# EasyEDA Pro project 2022年第十三届立创EDA出品模拟题2.eprj

# Schematic 【蓝桥杯练习题二】第十三届蓝桥杯EDA赛模拟题
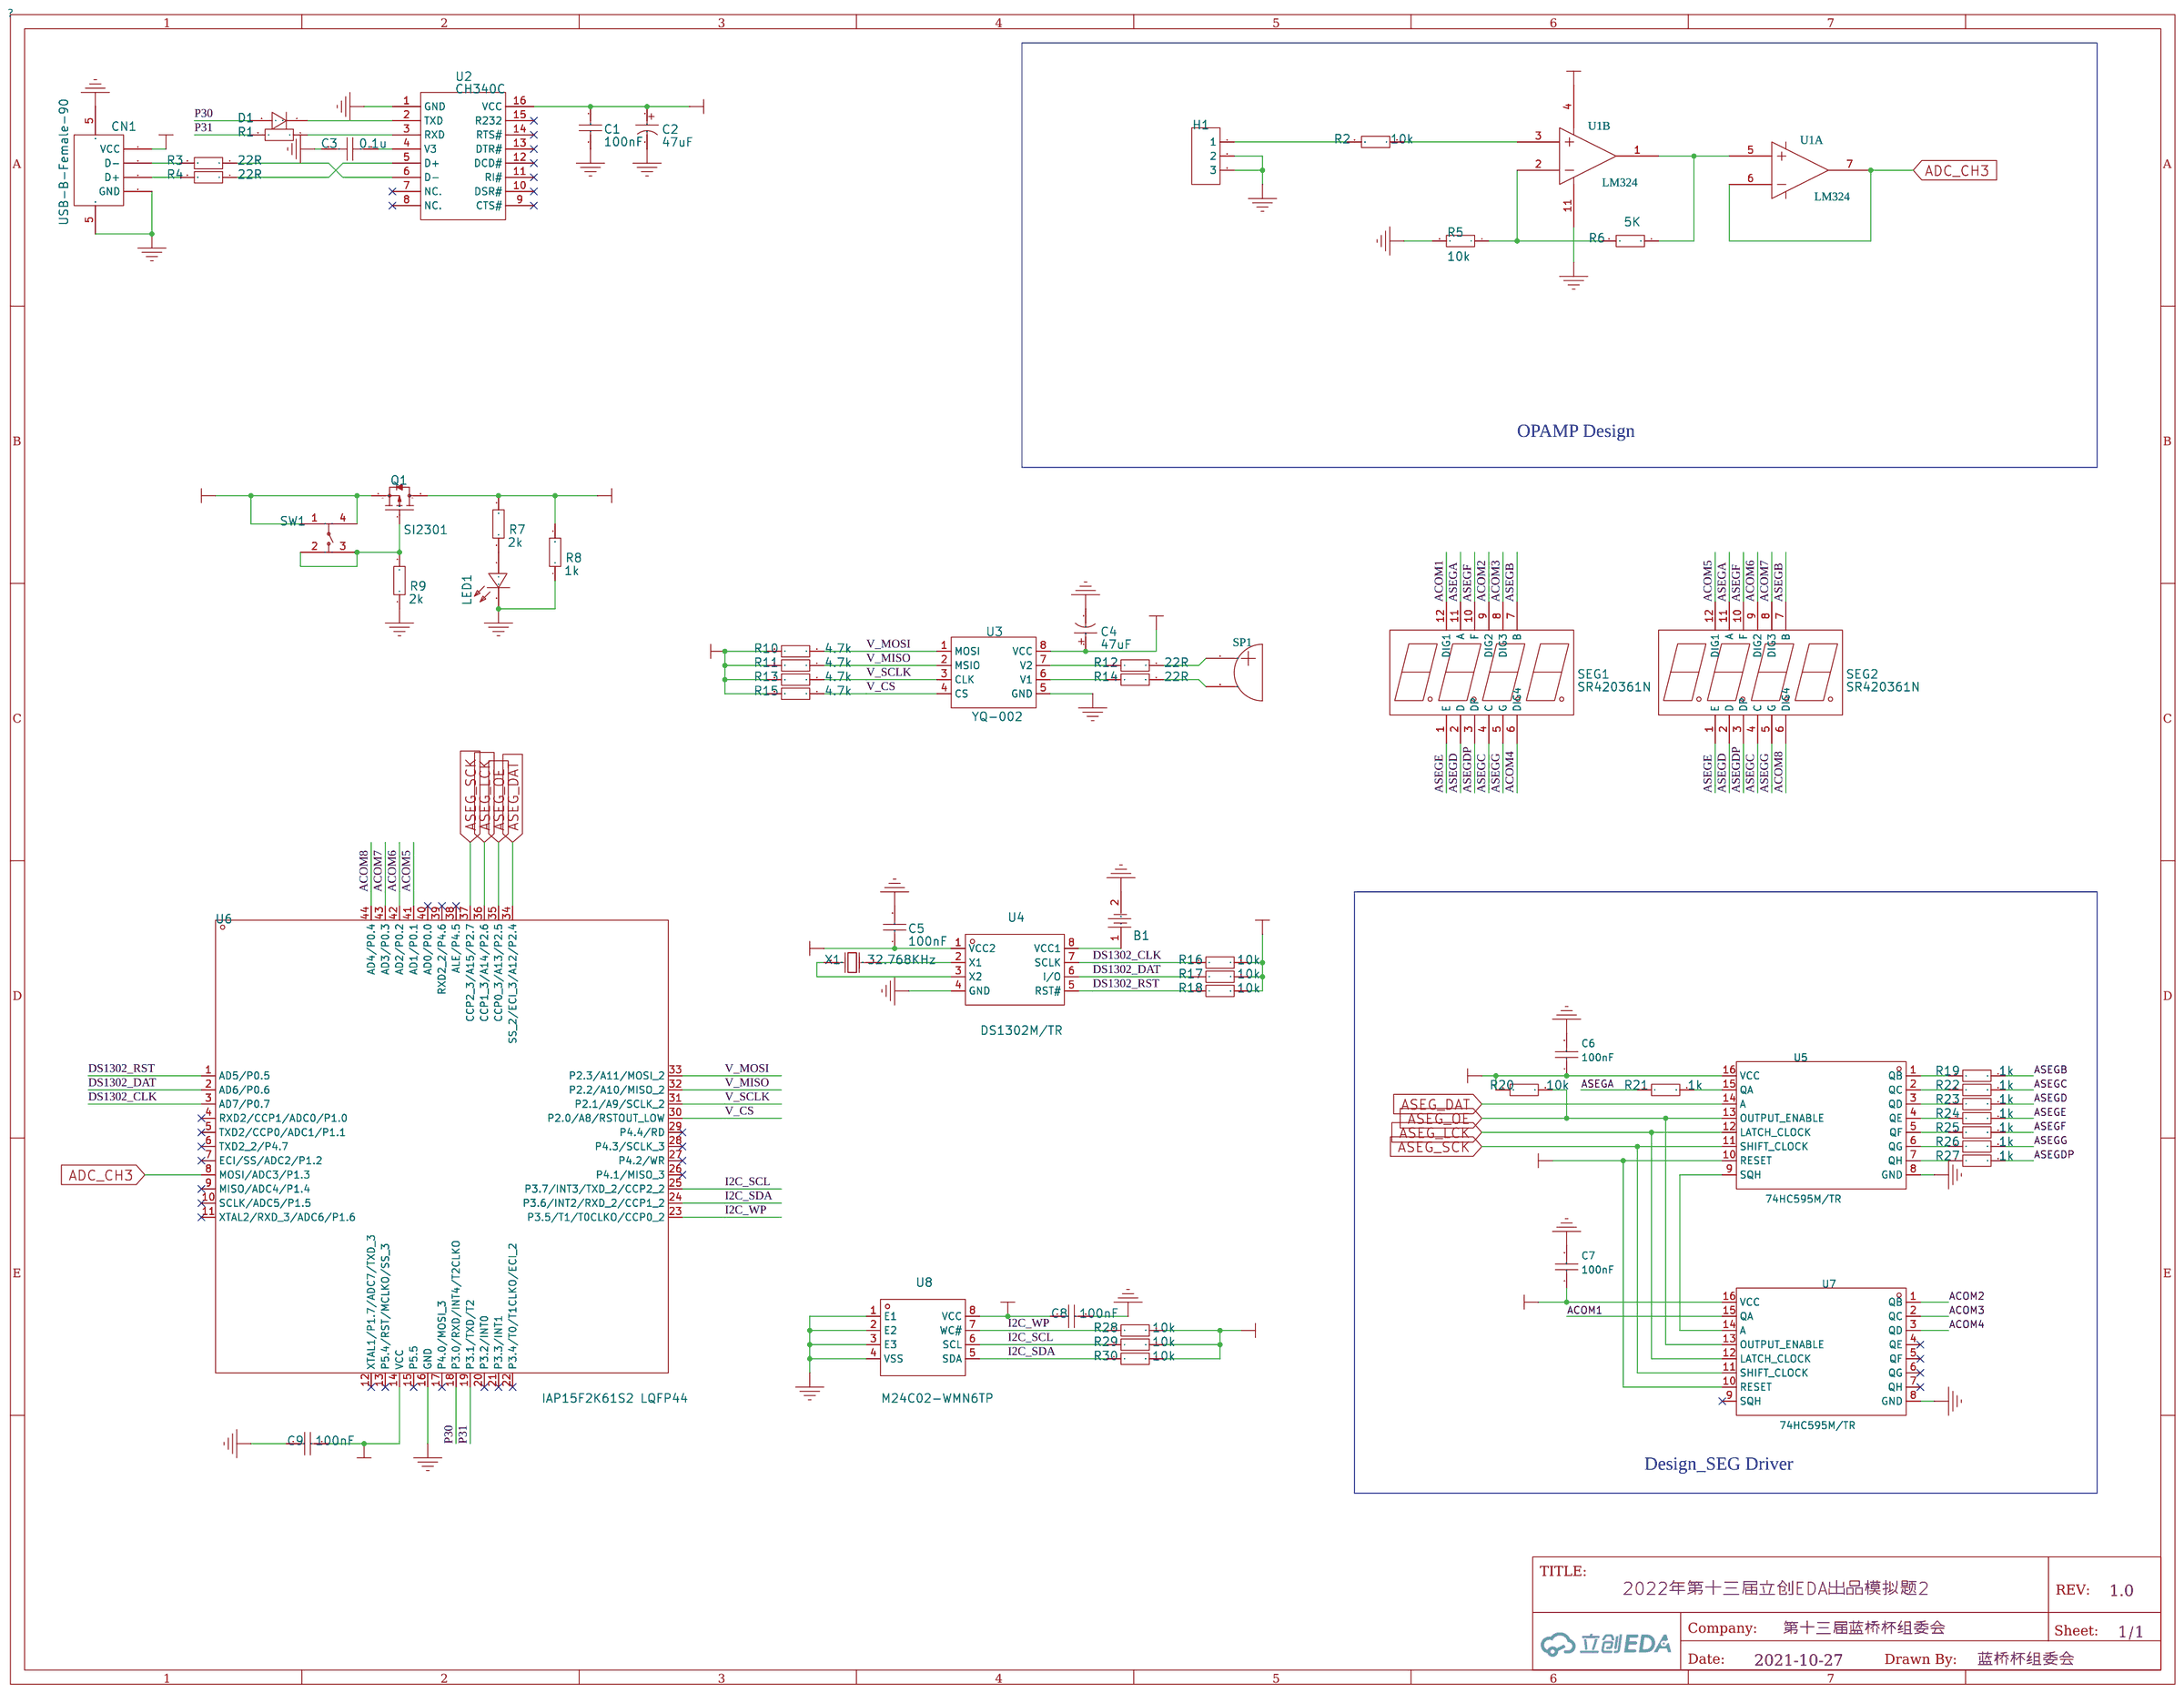
[diagram p0: schematic sheet]

## Parts
B1  CR1220-2  [BAT-CR1220]
C1  100nF  [C0805]
C2  47uF  [CAP]
C3  0.1u  [C0805]
C4  47uF  [CAP]
C5  100nF  [C0805]
C6  100nF  [C0805]
C7  100nF  [C0805]
C8  100nF  [C0805]
C9  100nF  [C0805]
CN1  USB-B-Female-90  [USB-B]
D1  KLL4148  [DIODE]
H1  HDR-F-2.54_1x3  [HDR-F-2.54_1X3]
LED1  17-21URC/TR8  [LED0805]
Q1  SI2301  [SOT-23-3]
R1  1k  [R0805]
R2  10k  [R0805]
R3  22R  [R0805]
R4  22R  [R0805]
R5  10k  [R0805]
R6  5K  [R0805]
R7  2k  [R0805]
R8  1k  [R0805]
R9  2k  [R0805]
R10  4.7k  [R0805]
R11  4.7k  [R0805]
R12  22R  [R0805]
R13  4.7k  [R0805]
R14  22R  [R0805]
R15  4.7k  [R0805]
R16  10k  [R0805]
R17  10k  [R0805]
R18  10k  [R0805]
R19  1k  [R0805]
R20  10k  [R0805]
R21  1k  [R0805]
R22  1k  [R0805]
R23  1k  [R0805]
R24  1k  [R0805]
R25  1k  [R0805]
R26  1k  [R0805]
R27  1k  [R0805]
R28  10k  [R0805]
R29  10k  [R0805]
R30  10k  [R0805]
SEG1  SR420361N  [LED-SEG]
SEG2  SR420361N  [LED-SEG]
SP1  BUZZER  [BUZZ]
SW1  TS-1159UB-B-D-BL  [SW-SMD_4P]
U1  LM324  [SOIC-14]  (sections 1,2)
U2  CH340C  [SOP-16]
U3  YQ-002  [SOP-8]
U4  DS1302M/TR  [SOP-8]
U5  74HC595M/TR  [SOP-16]
U6  IAP15F2K61S2 LQFP44  [QFP-LQFP-44]
U7  74HC595M/TR  [SOP-16]
U8  M24C02-WMN6TP  [SOP-8]
X1  32.768KHz  [XTAL-DT38]

## Library data of the parts
B1 = CR1220-2: Supplier: LCSC; Manufacturer: Q&amp;J; image: //image.lceda.cn/szlcsc/C70381.jpg; Supplier Part: C70381
C1 C5 C8 C9 = 0805F104M500NT: Supplier: LCSC; Manufacturer: FH; Supplier Part: C28378
C2 C4 = VES470M1HTR-0607: Supplier: LCSC; Manufacturer: LELON; Supplier Part: C108053; JLCPCB Part Class: Extended Part
C3 = 0.1u
C6 C7 = 100nF
CN1 = USB-BF90: Supplier: LCSC; Manufacturer: ValuePro; image: //image.lceda.cn/szlcsc/C46392.jpg; Supplier Part: C46392
D1 = KLL4148: Supplier: LCSC; Supplier Part: C369941; Manufacturer: KEXIN
H1 = HDR-F-2.54_1x3: Supplier Part: C146690; Supplier: LCSC
LED1 = 17-21URC/TR8: Supplier: LCSC; Supplier Part: C264414; Manufacturer: Everlight Elec
Q1 = SI2301: Supplier: LCSC; Manufacturer: Hottech; Supplier Part: C181086; JLCPCB Part Class: Extend
R1-R30 = 080500J0104T5E: Supplier: LCSC; Manufacturer: UniOhm; Supplier Part: C149503
SEG1 SEG2 = SR420361N: Supplier: LCSC; Supplier Part: C98926; Manufacturer: Wuxi ARK Tech Elec; JLCPCB Part Class: Extended Part
SP1 = BUZZER
SW1 = TS-1159UB-B-D-BL: Supplier: LCSC; Supplier Part: C692480; Manufacturer: XKB Connectivity
U1 = LM324
U2 = CH340C: Supplier: LCSC; Manufacturer: WCH; Supplier Part: C84681; JLCPCB Part Class: Extend
U3 = YQ-002
U4 = DS1302M/TR: Supplier: LCSC; Supplier Part: C434511; Manufacturer: HGSEMI
U5 U7 = 74HC595M/TR
U6 = IAP15F2K61S2 LQFP44: Supplier: LCSC; Manufacturer: STC; Supplier Part: C47451; JLCPCB Part Class: Extend
U8 = M24C02-WMN6TP: Supplier: LCSC; Manufacturer: STMicroelectronics; image: //image.lceda.cn/szlcsc/C7562.jpg; Supplier Part: C7562; JLCPCB Part Class: Basic
X1 = 6K832768F12UB: Supplier: LCSC; Supplier Part: C252404; Manufacturer: SHENZHEN CRYSTAL TECH

## Nets
GND: B1.2 C1.1 C2.2 C3.1 C4.2 C5.2 C6.2 C7.2 C8.2 C9.1 CN1.4(GND) CN1.5(SH2) H1.2 H1.3 LED1.2(K) R5.2 R8.1 R9.1 U1.11 U2.1(GND) U3.5(GND) U4.4(GND) U5.8(GND) U6.16(GND) U7.8(GND) U8.1(E1) U8.2(E2) U8.3(E3) U8.4(VSS)
VDD_NODE_A: C4.1 C5.1 C6.1 C7.1 C8.1 C9.2 Q1.3(D) R7.2 R8.2 R10.2 R11.2 R13.2 R15.2 R16.2 R17.2 R18.2 R20.1 R28.2 R29.2 R30.2 U1.4 U3.8(VCC) U4.1(VCC2) U5.10(RESET) U5.16(VCC) U6.14(VCC) U7.10(RESET) U7.16(VCC) U8.8(VCC)
ACOM1: SEG1.12(DIG1) U7.15(QA)
ACOM2: SEG1.9(DIG2) U7.1(QB)
ACOM3: SEG1.8(DIG3) U7.2(QC)
ACOM4: SEG1.6(DIG4) U7.3(QD)
ACOM5: SEG2.12(DIG1) U6.41(AD1/P0.1)
ACOM6: SEG2.9(DIG2) U6.42(AD2/P0.2)
ACOM7: SEG2.8(DIG3) U6.43(AD3/P0.3)
ACOM8: SEG2.6(DIG4) U6.44(AD4/P0.4)
ADC_CH3: U1.6 U1.7 U6.8(MOSI/ADC3/P1.3)
ASEG_DAT: U5.14(A) U6.34(SS_2/ECI_3/A12/P2.4)
ASEG_LCK: U5.12(LATCH_CLOCK) U6.36(CCP1_3/A14/P2.6) U7.12(LATCH_CLOCK)
ASEG_OE: R20.2 U5.13(OUTPUT_ENABLE) U6.35(CCP0_3/A13/P2.5) U7.13(OUTPUT_ENABLE)
ASEG_SCK: U5.11(SHIFT_CLOCK) U6.37(CCP2_3/A15/P2.7) U7.11(SHIFT_CLOCK)
ASEGA: R21.1 SEG1.11(A) SEG2.11(A)
ASEGB: R19.2 SEG1.7(B) SEG2.7(B)
ASEGC: R22.2 SEG1.4(C) SEG2.4(C)
ASEGD: R23.2 SEG1.2(D) SEG2.2(D)
ASEGDP: R27.2 SEG1.3(DP) SEG2.3(DP)
ASEGE: R24.2 SEG1.1(E) SEG2.1(E)
ASEGF: R25.2 SEG1.10(F) SEG2.10(F)
ASEGG: R26.2 SEG1.5(G) SEG2.5(G)
DS1302_CLK: R16.1 U4.7(SCLK) U6.3(AD7/P0.7)
DS1302_DAT: R17.1 U4.6(I/O) U6.2(AD6/P0.6)
DS1302_RST: R18.1 U4.5(RST#) U6.1(AD5/P0.5)
I2C_SCL: R29.1 U6.25(P3.7/INT3/TXD_2/CCP2_2) U8.6(SCL)
I2C_SDA: R30.1 U6.24(P3.6/INT2/RXD_2/CCP1_2) U8.5(SDA)
I2C_WP: R28.1 U6.23(P3.5/T1/T0CLKO/CCP0_2) U8.7(WC#)
P30: D1.2(A) U6.18(P3.0/RXD/INT4/T2CLKO)
P31: R1.2 U6.19(P3.1/TXD/T2)
V_CS: R15.1 U3.4(CS) U6.30(P2.0/A8/RSTOUT_LOW)
V_MISO: R11.1 U3.2(MSIO) U6.32(P2.2/A10/MISO_2)
V_MOSI: R10.1 U3.1(MOSI) U6.33(P2.3/A11/MOSI_2)
V_SCLK: R13.1 U3.3(CLK) U6.31(P2.1/A9/SCLK_2)
VUSB: C1.2 C2.1 CN1.1(VCC) Q1.2(S) SW1.1 SW1.4(2) U2.16(VCC)
$1N50: H1.1 R2.2
$1N51: R2.1 U1.3
$1N54: R5.1 R6.2 U1.2
$1N55: R6.1 U1.1 U1.5
$1N115: B1.1 U4.8(VCC1)
$1N118: U4.3(X2) X1.1(OSC1)
$1N119: U4.2(X1) X1.2(OSC2)
$1N152: R14.1 U3.6(V1)
$1N153: R12.1 U3.7(V2)
$1N156: R14.2 SP1.2
$1N157: R12.2 SP1.1
$1N174: Q1.1(G) R9.2 SW1.2(4) SW1.3
$1N177: R4.1 U2.5(D+)
$1N178: R3.1 U2.6(D-)
$1N181: C3.2 U2.4(V3)
$1N182: R1.1 U2.3(RXD)
$1N183: D1.1(C) U2.2(TXD)
$1N192: CN1.3(D+) R4.2
$1N193: CN1.2(D-) R3.2
$1N730: LED1.1(A) R7.1
$1N1892: R21.2 U5.15(QA)
$1N2944: R27.1 U5.7(QH)
$1N2950: R26.1 U5.6(QG)
$1N2953: R25.1 U5.5(QF)
$1N2956: R24.1 U5.4(QE)
$1N2959: R23.1 U5.3(QD)
$1N2962: R22.1 U5.2(QC)
$1N2965: R19.1 U5.1(QB)
$1N3067: U5.9(SQH) U7.14(A)

Not connected (* = marked no-connect by the designer): U2 7(NC.)* 8(NC.)* 9(CTS#)* 10(DSR#)* 11(RI#)* 12(DCD#)* 13(DTR#)* 14(RTS#)* 15(R232)*; U6 4(RXD2/CCP1/ADC0/P1.0)* 5(TXD2/CCP0/ADC1/P1.1)* 6(TXD2_2/P4.7)* 7(ECI/SS/ADC2/P1.2)* 9(MISO/ADC4/P1.4)* 10(SCLK/ADC5/P1.5)* 11(XTAL2/RXD_3/ADC6/P1.6)* 12(XTAL1/P1.7/ADC7/TXD_3)* 13(P5.4/RST/MCLKO/SS_3)* 15(P5.5)* 17(P4.0/MOSI_3)* 20(P3.2/INT0)* 21(P3.3/INT1)* 22(P3.4/T0/T1CLKO/ECI_2)* 26(P4.1/MISO_3)* 27(P4.2/WR)* 28(P4.3/SCLK_3)* 29(P4.4/RD)* 38(ALE/P4.5)* 39(RXD2_2/P4.6)* 40(AD0/P0.0)*; U7 4(QE)* 5(QF)* 6(QG)* 7(QH)* 9(SQH)*

## Notes on the sheet
- OPAMP Design
- Design_SEG Driver

# Board PCB
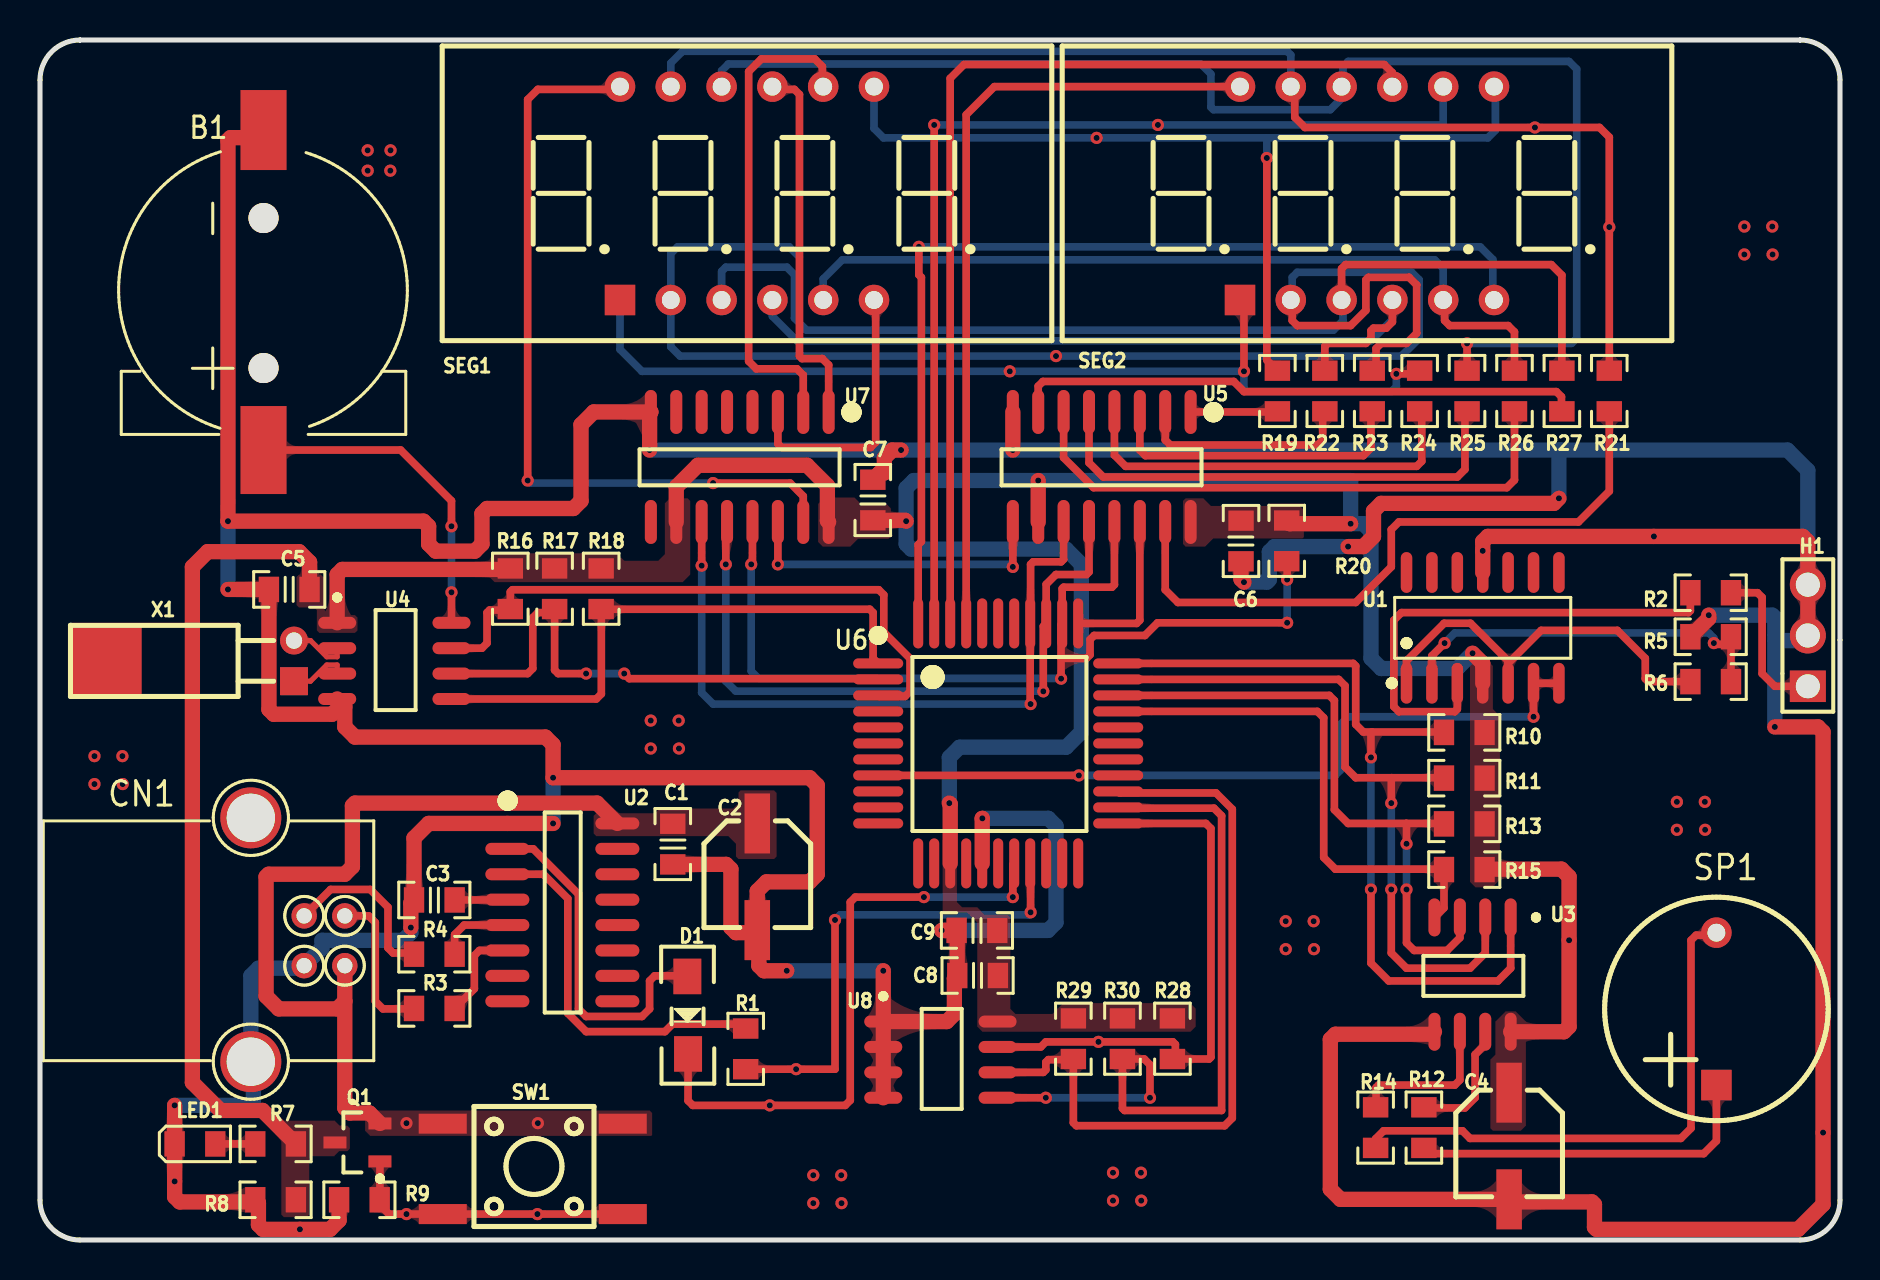
[diagram p1: board, top side]
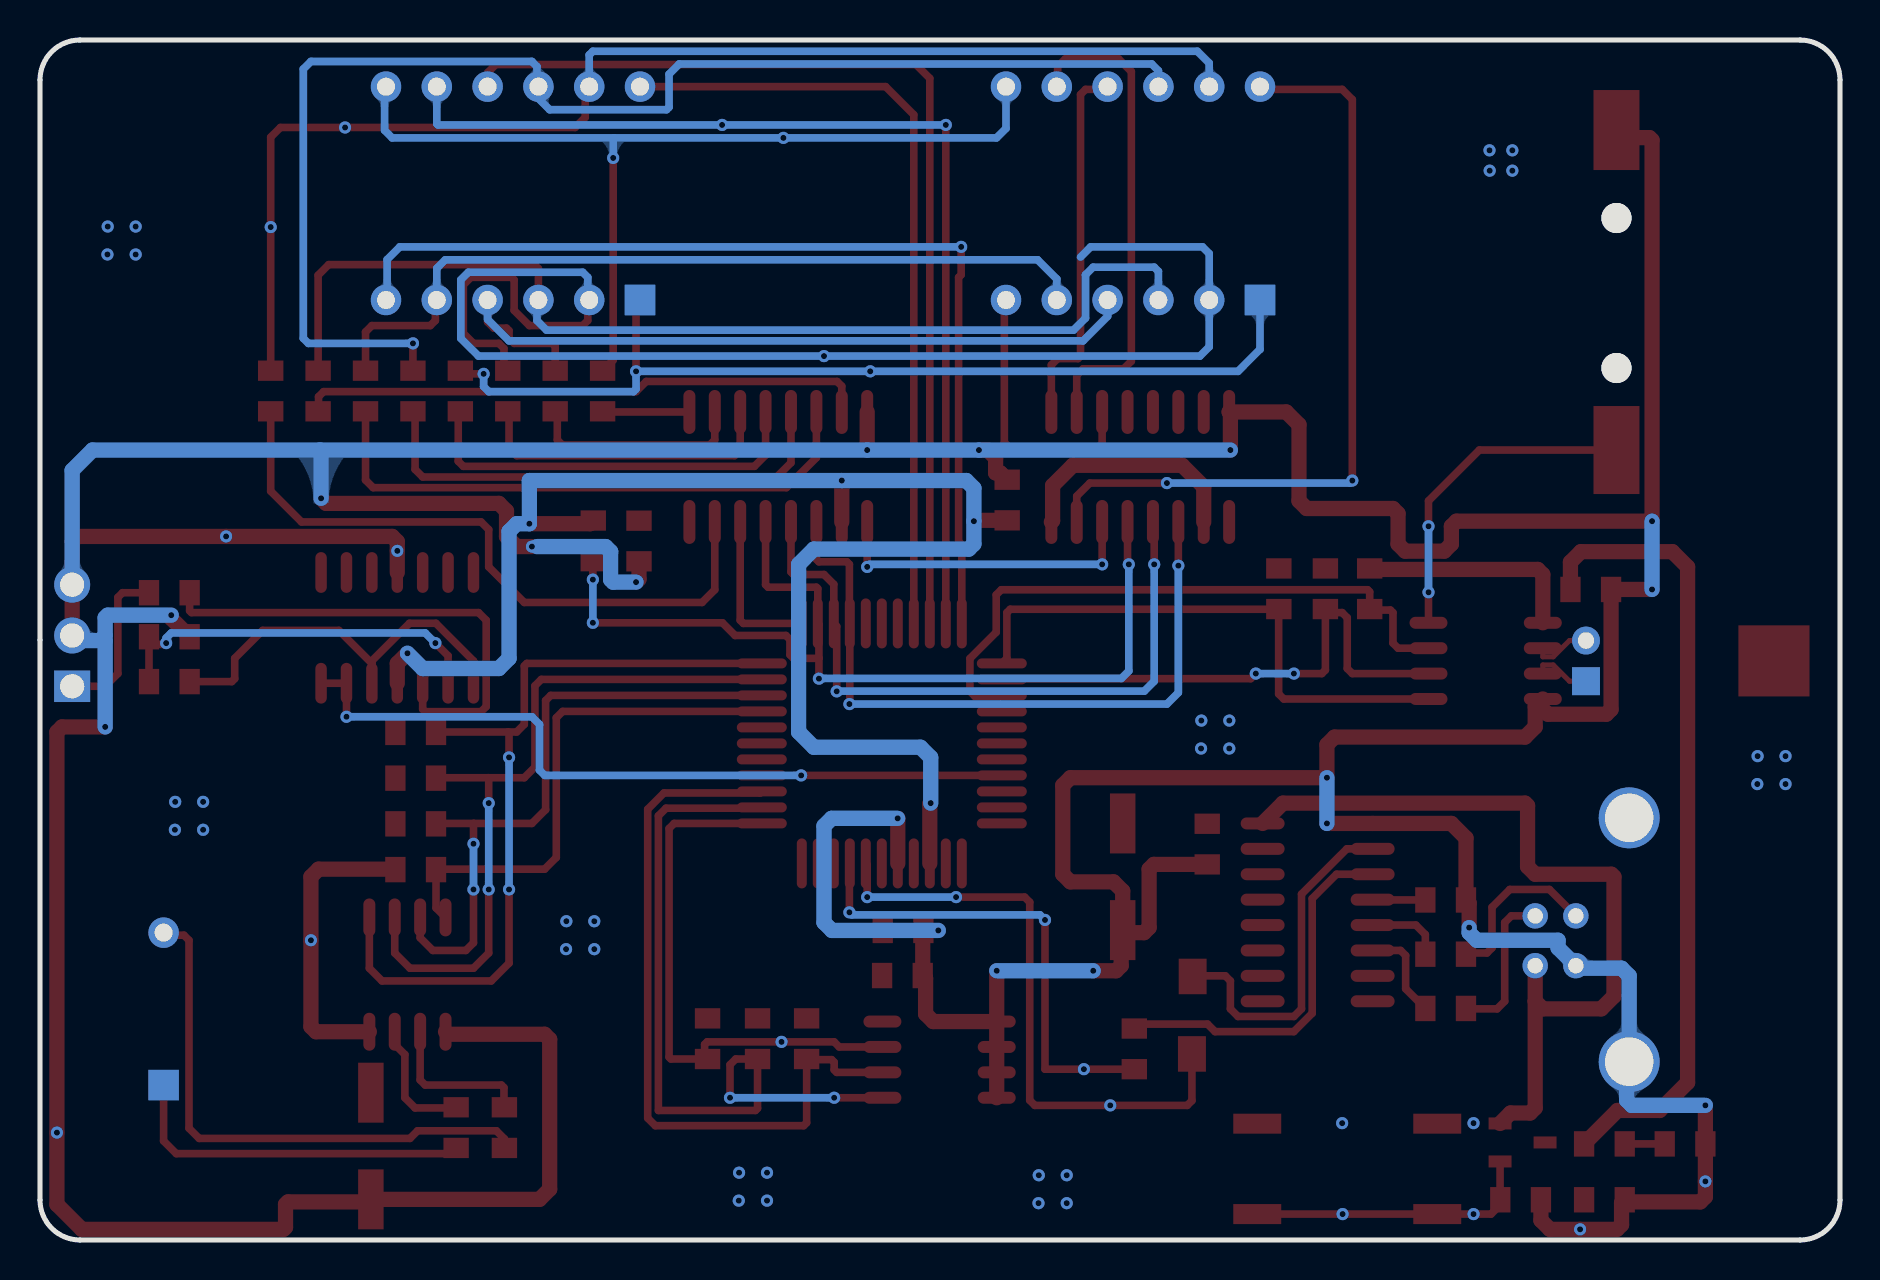
[diagram p2: board, bottom side, seen from below]

Outline 90 x 60 mm; copper layers: Top Layer, Inner1, Inner2, Bottom Layer. Coordinates in mm from the lower left corner of the outline.
Outline path: 0,58 0,2 arc(0.59,0.59) 2,0 88,0 arc(89.41,0.59) 90,2 90,58 arc(89.41,59.41) 88,60 2,60 arc(0.59,59.41) 0,58
Stack: Top Layer 0.035mm / Dielectric1 0.48mm PP er 4.5 / Inner1 0.035mm / Dielectric2 0.48mm FR4 er 4.5 / Inner2 0.035mm / Dielectric3 0.48mm PP er 4.5 / Bottom Layer 0.035mm

## Design rules (mm)
net $1N119: DP1
net $1N118: DP1
template: 用户自定义配置
spacing Default (default): track to track 0.152, other pairs 0 to 0.152
track width Default (default): min 0.381, default 0.381, max 25.4
track width PWR: min 0.762, default 0.762, max 2.54
differential pair differentialPair (default): width min 0.127, default 0.254, max 2.54; gap min 0.152, default 0.152
via Default (default): diameter min 0.61, default 0.61, max 100.025; hole min 0.305, default 0.305, max 59.995
net GND uses PWR
net VDD_NODE_A uses PWR
net VUSB uses PWR

## Placement (name value [footprint] x y rotation side)
B1  CR1220-2  [BAT-CR1220]  11.18 47.5 90 top
C1  100nF  [C0805]  31.62 18.8 90 top
C2  47uF  [CAP]  35.94 20.95 270 top
C3  0.1u  [C0805]  18.72 17.02 0 top
C4  47uF  [CAP]  73.53 7.49 270 top
C5  100nF  [C0805]  13.46 32.51 180 top
C6  100nF  [C0805]  60.07 35.95 270 top
C7  100nF  [C0805]  41.62 36 90 top
C8  100nF  [C0805]  47.88 13.21 180 top
C9  100nF  [C0805]  45.85 15.49 0 top
CN1  USB-B-Female-90  [USB-B]  15.24 13.72 270 top
D1  KLL4148  [DIODE]  32.38 11.24 270 top
H1  HDR-F-2.54_1x3  [HDR-F-2.54_1X3]  88.39 30.23 90 top
LED1  17-21URC/TR8  [LED0805]  8.76 4.81 180 top
Q1  SI2301  [SOT-23-3]  15.87 4.88 180 top
R1  1k  [R0805]  35.31 10.54 270 top
R2  10k  [R0805]  82.55 32.39 0 top
R3  22R  [R0805]  20.7 11.56 180 top
R4  22R  [R0805]  20.7 14.27 180 top
R5  10k  [R0805]  84.52 30.14 180 top
R6  5K  [R0805]  82.55 27.94 0 top
R7  2k  [R0805]  10.8 4.83 0 top
R8  1k  [R0805]  10.8 2.03 0 top
R9  2k  [R0805]  14.99 2.03 0 top
R10  4.7k  [R0805]  70.23 25.4 0 top
R11  4.7k  [R0805]  70.23 23.11 0 top
R12  22R  [R0805]  69.22 6.6 270 top
R13  4.7k  [R0805]  70.23 20.83 0 top
R14  22R  [R0805]  66.8 6.6 270 top
R15  4.7k  [R0805]  70.23 18.54 0 top
R16  10k  [R0805]  23.5 31.58 90 top
R17  10k  [R0805]  25.71 31.58 90 top
R18  10k  [R0805]  28.04 31.58 90 top
R19  1k  [R0805]  61.85 41.47 90 top
R20  10k  [R0805]  62.36 35.94 270 top
R21  1k  [R0805]  78.49 43.43 270 top
R22  1k  [R0805]  64.22 41.47 90 top
R23  1k  [R0805]  66.59 41.47 90 top
R24  1k  [R0805]  68.96 41.47 90 top
R25  1k  [R0805]  71.33 41.47 90 top
R26  1k  [R0805]  73.7 41.47 90 top
R27  1k  [R0805]  76.07 41.47 90 top
R28  10k  [R0805]  56.6 9.08 90 top
R29  10k  [R0805]  51.65 9.08 90 top
R30  10k  [R0805]  54.1 9.08 90 top
SEG1  SR420361N  [LED-SEG]  29 47 0 top
SEG2  SR420361N  [LED-SEG]  60 47 0 top
SP1  BUZZER  [BUZZ]  83.82 7.75 90 top
SW1  TS-1159UB-B-D-BL  [SW-SMD_4P]  24.64 3.56 0 top
U1  LM324  [SOIC-14]  72.14 30.61 0 top
U2  CH340C  [SOP-16]  23.37 20.83 0 top
U3  YQ-002  [SOP-8]  73.53 16.13 270 top
U4  DS1302M/TR  [SOP-8]  14.86 30.86 0 top
U5  74HC595M/TR  [SOP-16]  57.53 41.4 270 top
U6  IAP15F2K61S2 LQFP44  [QFP-LQFP-44]  41.91 28.83 0 top
U7  74HC595M/TR  [SOP-16]  39.43 41.4 270 top
U8  M24C02-WMN6TP  [SOP-8]  42.16 10.92 0 top
X1  32.768KHz  [XTAL-DT38]  12.7 27.94 270 top

## Footprints (pads in the part's own frame, mm; a bottom-side part is the same pattern mirrored in y, then rotated)
BAT-CR1220
  custom 4.4x2.3 smd: 1(-8,0)
  custom 4x2.3 smd: 2(8,0)
  round 1.5 hole 1.5x1.505: 3(-3.9,-0.001) 4(3.6,-0.001)
BUZZ
  custom 1.524x1.524 hole 0.894x0.889: 1(0,0)
  round 1.524 hole 0.894x0.889: 2(7.62,0)
C0805
  rect 1.016x1.27 smd: 1(-0.016,-0.015) 2(2.016,-0.015)
CAP
  rect 3x1.274 smd: 1(0.127,-0.076) 2(5.461,-0.076)
DIODE
  rect 1.778x1.397 smd: 1(-1.937,-0.018) 2(1.938,0.018)
HDR-F-2.54_1X3
  rect 1.575x1.8 hole 1.2x1.205: 1(-2.54,0)
  round 1.8 hole 1.205x1.2: 2(0,0) 3(2.54,0)
LED0805
  rect 1.016x1.27 smd: 1(0,0) 2(2.032,0)
LED-SEG
  custom 1.524x1.524 hole 0.894x0.889: 1(0,0)
  round 1.524 hole 0.889x0.894: 2(2.54,0) 3(5.08,0) 4(7.62,0) 5(10.16,0) 6(12.7,0) 7(12.7,10.668) 8(10.16,10.668) 9(7.62,10.668) 10(5.08,10.668) 11(2.54,10.668) 12(0,10.668)
QFP-LQFP-44
  oval 2.5x0.5 smd: 1(0,0) 2(0,-0.8) 3(0,-1.6) 4(0,-2.4) 5(0,-3.2) 6(0,-4) 7(0,-4.8) 8(0,-5.6) 9(0,-6.4) 10(0,-7.2) 11(0,-8) 23(12,-8) 24(12,-7.2) 25(12,-6.4) 26(12,-5.6) 27(12,-4.8) 28(12,-4) 29(12,-3.2) 30(12,-2.4) 31(12,-1.6) 32(12,-0.8) 33(12,0)
  oval 0.5x2.5 smd: 12(2,-10) 13(2.8,-10) 14(3.6,-10) 15(4.4,-10) 16(5.2,-10) 17(6,-10) 18(6.8,-10) 19(7.6,-10) 20(8.4,-10) 21(9.2,-10) 22(10,-10) 34(10,2) 35(9.2,2) 36(8.4,2) 37(7.6,2) 38(6.8,2) 39(6,2) 40(5.2,2) 41(4.4,2) 42(3.6,2) 43(2.8,2) 44(2,2)
R0805
  rect 1.016x1.27 smd: 1(-0.032,-0.021) 2(2,-0.021)
SOIC-14
  oval 0.574x2.038 smd: 1(-3.81,-2.769) 2(-2.54,-2.769) 3(-1.27,-2.769) 4(0,-2.769) 5(1.27,-2.769) 6(2.54,-2.769) 7(3.81,-2.769) 8(3.81,2.769) 9(2.54,2.769) 10(1.27,2.769) 11(0,2.769) 12(-1.27,2.769) 13(-2.54,2.769) 14(-3.81,2.769)
SOP-8
  custom 1.897x0.6 smd: 1(0,0) 2(0,-1.27) 3(0,-2.54) 4(0,-3.81) 5(5.716,-3.81) 6(5.716,-2.54) 7(5.716,-1.27) 8(5.716,0)
SOP-16
  oval 2.198x0.6 smd: 1(0,0) 2(0,-1.27) 3(0,-2.54) 4(0,-3.81) 5(0,-5.08) 6(0,-6.35) 7(0,-7.62) 8(0,-8.89) 9(5.5,-8.89) 10(5.5,-7.62) 11(5.5,-6.35) 12(5.5,-5.08) 13(5.5,-3.81) 14(5.5,-2.54) 15(5.5,-1.27) 16(5.5,0)
SOT-23-3
  rect 1.15x0.6 smd: 1(-1.125,0.95) 2(-1.125,-0.95) 3(1.125,0)
SW-SMD_4P
  rect 2.4x1 smd: 1(-4.5,2.26) 2(-4.5,-2.26) 3(4.5,-2.26) 4(4.5,2.26)
USB-B
  round 1.27 hole 0.767x0.762: 1(0,0) 2(-2.49,0) 3(-2.49,-2.032) 4(0,-2.032)
  round 3.048 hole 2.418x2.413: 5(4.801,-4.699) 6(-7.391,-4.699)
XTAL-DT38
  custom 3.556x3.556 smd: 0(-1.016,-9.398)
  custom 1.397x1.397 hole 0.818x0.813: 1(0,0)
  round 1.397 hole 0.818x0.813: 2(-2.032,0)

## Nets
As in the schematic.

Pads without a net: B1 3 4; CN1 6; U1 8 9 10 12 13 14; U2 7 8 9 10 11 12 13 14 15; U6 4 5 6 7 9 10 11 12 13 15 17 20 21 22 26 27 28 29 38 39 40; U7 4 5 6 7 9; X1 0

## Via types
v1: diameter 0.61, hole 0.305, Top Layer to Bottom Layer, 112 vias

## Routing (per net, layer and track width the routed paths; a pad name or vN(x,y) marks a point on that pad's centre or on a via; arc(x,y) is an arc through that point)
GND: length 391.5
  Top Layer w0.762: 14.95,1.76 14.95,0.98 14.5,0.53 v1(13,0.53) 11.15,0.53 10.92,0.76 10.92,1.85 R8.1 10.66,1.91 6.98,1.91 6.73,2.16 v1(6.73,2.93) LED1.2 v1(6.73,6.73) ; R5.2 83.44,31.08 v1(83.44,31.24) ; v1(45.09,15.48) C9.1 45.86,15.45 C8.2 45.72,13.08 45.72,11.3 45.34,10.92 U8.1 ; C6.2 60.05,33.04 v1(60.2,32.89) ; v1(43.05,39.5) 42.61,39.5 42.22,39.1 42.22,38.35 41.98,38.35 C7.2 ; v1(9.4,32.53) C5.2 11.45,26.53 11.68,26.29 14.61,26.29 14.99,26.67 14.99,26.92 ; U8.1 v1(42.16,13.46) ; U8.1 U8.2 U8.3 U8.4 ; 14.99,26.92 U4.4 ; 14.99,26.92 15.24,26.67 15.24,25.65 15.75,25.15 25.27,25.15 25.65,24.77 v1(25.65,23.11) 38.48,23.11 38.86,22.73 38.86,18.29 38.48,17.91 36.32,17.91 35.86,17.45 C2.2 ; v1(75.95,37.08) 75.69,36.83 67.06,36.83 66.68,36.45 66.68,35.18 66.17,34.67 v1(65.41,34.67) ; v1(18.54,15.62) 18.54,16.84 C3.1 18.7,20.1 19.43,20.83 U2.1 v1(25.65,20.83) ; U1.11 v1(72.14,34.46) 72.14,34.92 72.39,35.18 v1(80.69,35.18) 88.14,35.18 88.39,34.92 H1.3 H1.2 ; C2.2 35.74,15.37 34.8,15.37 34.54,15.62 34.54,18.54 34.31,18.78 C1.1 ; C2.2 35.94,15.42 35.94,13.72 36.19,13.46 v1(37.34,13.46) ; v1(30.48,39.5) 30.48,41.34 U7.8 27.69,41.4 27.05,40.77 27.05,36.96 26.67,36.58 22.35,36.58 22.1,36.32 22.1,34.8 21.74,34.44 19.79,34.44 19.43,34.8 19.43,35.69 19.18,35.94 v1(9.4,35.94) 9.4,54.99 9.53,55.12 10.8,55.12 B1.2 ; v1(47.12,21.08) 47.11,21.08 U6.16 ; v1(48.64,39.5) 48.64,41.4 ; 69.72,10.41 69.6,10.29 64.77,10.29 64.52,10.03 64.52,2.54 65.02,2.03 C4.2 73.58,1.91 77.6,1.91 77.72,1.78 77.72,0.63 77.83,0.53 87.91,0.53 89.15,1.78 v1(89.15,5.37) 89.15,25.4 88.9,25.65 v1(86.74,25.65)
  Bottom Layer w0.762: H1.2 88.14,29.97 87,29.97 ; v1(86.74,25.65) 86.74,29.97 87,29.97 ; 87,29.97 86.74,30.23 86.74,31.11 86.61,31.24 v1(83.44,31.24) ; H1.3 88.39,38.48 87.38,39.5 76,39.5 ; v1(42.16,13.46) v1(37.34,13.46) ; v1(9.4,32.53) v1(9.4,35.94) ; v1(75.95,37.08) 75.95,39.44 76,39.5 ; 76,39.5 v1(48.64,39.5) v1(43.05,39.5) v1(30.48,39.5) ; v1(45.09,15.48) 50.4,15.48 50.8,15.88 50.8,20.7 50.42,21.08 v1(47.12,21.08) ; 65.15,34.67 61.72,34.67 61.47,34.42 61.47,33.02 61.34,32.89 v1(60.2,32.89) ; v1(18.54,15.62) 18.54,15.37 18.16,14.99 14.1,14.99 14.1,14.61 CN1.4 13.08,13.59 10.92,13.59 10.54,13.21 CN1.5 10.67,8.79 10.67,6.99 10.41,6.73 v1(6.73,6.73) ; v1(25.65,20.83) v1(25.65,23.11)
  vias: v1(2.72,24.19) v1(2.72,22.8) v1(4.12,24.19) v1(4.14,22.8) v1(16.38,54.48) v1(16.38,53.47) v1(17.53,54.48) v1(17.52,53.47) v1(30.54,25.97) v1(30.54,24.57) v1(31.93,25.97) v1(31.95,24.57) v1(38.66,3.24) v1(38.66,1.84) v1(40.06,3.24) v1(40.08,1.84) v1(53.65,3.37) v1(53.65,1.97) v1(55.05,3.37) v1(55.06,1.97) v1(62.29,15.94) v1(62.29,14.54) v1(63.68,15.94) v1(63.7,14.54) v1(81.84,21.91) v1(81.84,20.51) v1(83.24,21.91) v1(83.26,20.51) v1(85.22,50.67) v1(85.22,49.28) v1(86.61,50.67) v1(86.63,49.28)
VDD_NODE_A: length 157.3
  Top Layer w0.762: v1(65.53,35.81) 62.5,35.81 R20.1 ; v1(49.91,37.97) U5.10 ; 41.64,35.98 43.26,35.98 v1(43.31,35.94) ; R7.2 11.12,6.48 9.02,6.48 7.62,7.87 7.62,33.66 8.38,34.42 12.95,34.42 13.48,33.89 C5.1 ; R15.2 72.25,18.54 76.07,18.54 76.45,18.16 v1(76.45,14.99) 76.45,10.67 76.2,10.41 U3.8 ; U6.14 45.51,21.8 v1(45.47,21.84) ; R16.2 23.47,33.53 15.11,33.53 14.86,33.27 U4.1 ; U7.10 31.81,37.66 32.89,38.73 38.35,38.73 39.37,37.72 39.37,35.97 U7.16 ; v1(71.63,29.34) 72.14,28.83 U1.4
  Bottom Layer w0.762: v1(71.63,29.34) 70.87,28.58 67.06,28.58 66.55,29.08 66.55,35.43 66.17,35.81 v1(65.53,35.81) 65.53,37.97 v1(49.91,37.97) 43.69,37.97 43.31,37.59 v1(43.31,35.94) 43.31,34.8 43.56,34.54 51.31,34.54 52.07,33.78 52.07,25.4 51.31,24.64 45.97,24.64 45.47,24.13 v1(45.47,21.84)
ACOM1: length 39.3
  Top Layer w0.381: SEG1.12 28.86,57.53 24.89,57.53 24.38,57.02 v1(24.38,37.97) ; 38.16,35.9 38.16,37.19 37.51,37.85 v1(33.66,37.85)
  Bottom Layer w0.381: v1(33.66,37.85) 24.51,37.85 v1(24.38,37.97)
ACOM2: length 18.6
  Top Layer w0.381: SEG1.9 36.76,57.53 37.72,57.53 37.97,57.28 37.97,44.2 38.1,44.07 39.12,44.07 39.43,43.75 U7.1
ACOM3: length 24.5
  Top Layer w0.381: SEG1.8 39.12,57.71 39.12,58.67 38.74,59.06 36.07,59.06 35.43,58.42 35.43,43.94 35.81,43.56 37.85,43.56 38.16,43.24 38.16,41.4
ACOM4: length 13.8
  Top Layer w0.381: U7.3 36.89,39.81 37.08,39.62 41.53,39.62 41.78,39.88 41.78,46.92 SEG1.6
ACOM5: length 39.7
  Top Layer w0.381: SEG2.12 47.72,57.67 46.31,56.26 U6.41
ACOM6: length 50.5
  Top Layer w0.381: U6.42 45.51,58.08 46.2,58.77 67.21,58.77 67.62,58.36 SEG2.9
ACOM7: length 52.3
  Top Layer w0.381: U6.43 v1(44.71,55.75)
  Bottom Layer w0.381: SEG2.8 70.16,55.81 70.1,55.75 v1(55.9,55.75) v1(44.71,55.75)
ACOM8: length 50
  Top Layer w0.381: U6.44 43.91,34.77 44.07,34.92 44.07,48.13 43.94,48.26 v1(43.94,49.66)
  Bottom Layer w0.381: v1(43.94,49.66) 72.01,49.66 72.64,49.02 72.64,47.06 SEG2.6
ADC_CH3: length 38.3
  Top Layer w0.381: v1(74.68,26.16) U1.6 U1.7 ; U6.8 v1(51.94,23.23)
  Bottom Layer w0.381: v1(51.94,23.23) 64.76,23.23 65.02,23.5 65.02,25.78 65.41,26.16 v1(74.68,26.16)
ASEG_DAT: length 8.1
  Top Layer w0.381: U6.34 54.83,30.83 54.99,30.99 U5.14
ASEG_LCK: length 34.4
  Top Layer w0.381: U5.12 52.45,33.4 52.32,33.27 50.8,33.27 50.31,32.78 U6.36 50.16,30.68 v1(50.16,27.43) ; v1(34.29,33.78) 34.29,35.84 U7.12
  Bottom Layer w0.381: v1(50.16,27.43) 50.15,27.44 34.79,27.44 34.29,27.94 v1(34.29,33.78)
ASEG_OE: length 49.1
  Top Layer w0.381: R20.2 62.36,33.92 v1(62.36,33.02) ; 51.05,29.1 51.07,29.08 52.32,29.08 52.5,29.26 52.5,30.02 52.71,30.23 55.25,30.23 55.88,30.86 v1(62.36,30.86) ; 51.05,29.1 v1(51.05,28.07) ; 51.05,29.1 51.05,30.77 U6.35 51.11,32.57 51.18,32.64 53.59,32.64 53.72,32.77 U5.13 ; v1(35.56,33.78) 35.62,33.84 U7.13
  Bottom Layer w0.381: v1(35.56,33.78) 35.56,28.45 35.93,28.08 51.04,28.08 v1(51.05,28.07) ; v1(62.36,33.02) v1(62.36,30.86)
ASEG_SCK: length 35.8
  Top Layer w0.381: v1(49.53,26.8) 49.51,26.82 U6.37 49.53,30.85 49.53,33.78 49.66,33.91 51.05,33.91 51.18,34.04 U5.11 ; U7.11 v1(33.08,33.72)
  Bottom Layer w0.381: v1(33.08,33.72) 33.08,27.37 33.66,26.8 v1(49.53,26.8)
ASEGA: length 63.5
  Top Layer w0.381: SEG2.11 62.74,57.47 62.74,56.13 63.25,55.63 v1(74.75,55.63) 77.98,55.63 78.47,55.14 v1(78.47,50.65) R21.1
  Bottom Layer w0.381: SEG1.11 31.54,58.84 32.13,59.44 62.36,59.44 62.54,59.25 SEG2.11
ASEGB: length 47.6
  Top Layer w0.381: v1(61.34,54.1) 61.34,44 R19.2
  Bottom Layer w0.381: v1(61.34,54.1) 61.34,55.07 61.31,55.11 ; 61.31,55.11 v1(52.83,55.11) 42.18,55.11 41.7,55.58 SEG1.7 ; 61.31,55.11 72.39,55.11 72.77,55.49 72.77,57.6 SEG2.7
ASEGC: length 40.2
  Top Layer w0.381: R22.2 64.24,44.68 64.39,44.83 66.29,44.83 66.55,45.08 66.55,45.47 66.68,45.59 67.31,45.59 67.62,45.9 SEG2.4
  Bottom Layer w0.381: SEG1.4 36.62,46.18 37.85,44.96 66.55,44.96 67.62,46.03 SEG2.4
ASEGD: length 75.5
  Top Layer w0.381: R23.2 66.8,43.66 66.8,44.58 67.06,44.83 68.33,44.83 68.83,45.34 68.83,47.75 68.45,48.13 66.42,48.13 66.29,48.01 66.29,46.48 65.53,45.72 62.87,45.72 62.61,45.97 62.61,46.93 SEG2.2
  Bottom Layer w0.381: SEG2.2 62.61,47.07 62.61,48.13 62.87,48.39 68.58,48.39 68.96,48.01 68.96,45.08 68.07,44.2 v1(50.8,44.2) 32,44.2 31.54,44.66 SEG1.2 31.54,49.32 31.88,49.66 37.47,49.66 37.97,49.15
ASEGDP: length 54.1
  Top Layer w0.381: SEG2.3 65.08,48.57 65.28,48.77 75.56,48.77 76.09,48.24 R27.2
  Bottom Layer w0.381: SEG2.3 65.15,46.93 65.15,45.97 64.67,45.49 38.33,45.49 37.72,46.09 37.72,48.26 37.34,48.64 34.29,48.64 34.08,48.43 SEG1.3
ASEGE: length 48.3
  Top Layer w0.381: R24.2 68.82,43.31 v1(67.82,43.31) ; SEG2.1 60.2,46.8 v1(60.2,43.43)
  Bottom Layer w0.381: SEG1.1 29,44.53 30.1,43.43 v1(48.49,43.43) v1(60.2,43.43) 60.2,42.55 60.32,42.42 67.56,42.42 67.82,42.67 v1(67.82,43.31)
ASEGF: length 68.1
  Top Layer w0.381: R25.2 v1(71.35,44.83)
  Bottom Layer w0.381: SEG1.10 34.08,58.46 34.42,58.8 58.04,58.8 58.55,58.29 58.55,56.64 58.67,56.52 64.52,56.52 65.08,57.08 SEG2.10 65.15,57.74 65.15,58.67 65.41,58.93 76.45,58.93 76.84,58.55 76.84,45.08 76.58,44.83 v1(71.35,44.83)
ASEGG: length 40.9
  Top Layer w0.381: SEG2.5 70.23,46.93 70.23,45.97 70.49,45.72 73.41,45.72 73.72,45.4 R26.2
  Bottom Layer w0.381: SEG1.5 39.16,48.05 40.12,49.01 69.74,49.01 70.16,48.58 SEG2.5
DS1302_CLK: length 31.4
  Top Layer w0.381: 20.58,29.59 22.1,29.59 22.35,29.84 22.35,31.37 22.48,31.5 23.47,31.5 R16.1 23.52,32.41 23.62,32.51 41.94,32.51 42.19,32.26 42.19,30.39 43.5,29.07 43.5,27.43 43.25,27.18 41.96,27.18 U6.3
DS1302_DAT: length 27.4
  Top Layer w0.381: v1(27.31,28.32) 25.91,28.32 25.73,28.5 R17.1 25.55,31.37 24.89,31.37 24.64,31.11 24.64,28.58 24.38,28.32 20.58,28.32 ; v1(29.21,28.32) 29.46,28.07 41.87,28.07 U6.2
  Bottom Layer w0.381: v1(27.31,28.32) v1(29.21,28.32)
DS1302_RST: length 28.1
  Top Layer w0.381: 28.07,31.54 R18.1 ; 28.07,31.54 41.49,31.54 41.66,31.37 41.66,29.08 U6.1 ; 28.07,31.54 28.07,27.31 27.81,27.05 20.58,27.05
I2C_SCL: length 37.2
  Top Layer w0.381: U8.6 50.16,8.38 50.29,8.51 50.29,8.89 50.42,9.02 51.64,9.02 R29.1 51.67,5.86 51.82,5.72 59.23,5.72 59.61,6.1 59.61,21.54 58.8,22.35 53.99,22.35 U6.25
I2C_SDA: length 38.3
  Top Layer w0.381: U6.24 53.95,21.59 58.7,21.59 59.08,21.21 59.08,6.48 54.23,6.48 54.12,6.58 R30.1 55.21,9.05 55.5,8.76 v1(55.5,7.11) ; U8.5 v1(50.29,7.11)
  Bottom Layer w0.381: v1(50.29,7.11) v1(55.5,7.11)
I2C_WP: length 28
  Top Layer w0.381: U8.7 50.04,9.65 50.29,9.91 v1(52.92,9.91) 56.64,9.91 56.77,9.78 56.77,9.2 56.62,9.05 58.45,9.05 58.55,9.14 58.55,20.57 58.29,20.83 53.91,20.83
P30: length 30.5
  Top Layer w0.381: D1.2 32.4,6.97 32.64,6.73 v1(36.49,6.73) 40.26,6.73 40.51,6.99 40.51,16.89 40.77,17.14 v1(44.2,17.14) ; v1(48.64,17.14) 48.64,18.76 U6.18
  Bottom Layer w0.381: v1(44.2,17.14) v1(48.64,17.14)
P31: length 24.3
  Top Layer w0.381: v1(39.75,16) 39.75,8.54 v1(37.81,8.54) 35.28,8.54 ; U6.19 49.53,18.81 v1(49.53,16.38)
  Bottom Layer w0.381: v1(49.53,16.38) 49.4,16.26 40,16.26 v1(39.75,16)
V_CS: length 26.2
  Top Layer w0.381: 69.72,16.13 70.2,16.61 70.2,18.52 70.18,18.54 64.77,18.54 64.19,19.13 64.19,26.11 63.87,26.43 U6.30
V_MISO: length 36.6
  Top Layer w0.381: 70.2,23.09 70.18,23.11 67.58,23.11 ; v1(67.56,21.84) 67.56,23.1 67.58,23.11 ; v1(67.56,17.53) 67.56,14.35 68.33,13.59 71.5,13.59 72.26,14.35 72.26,16.13 ; U6.32 64.94,28.03 65.25,27.71 65.25,23.65 65.79,23.11 67.58,23.11
  Bottom Layer w0.381: v1(67.56,21.84) v1(67.56,17.53)
V_MOSI: length 41.2
  Top Layer w0.381: U3.1 73.53,13.59 72.9,12.95 67.44,12.95 66.55,13.84 v1(66.55,17.53) ; v1(66.55,24.13) 66.55,25.36 66.59,25.4 ; 66.59,25.4 66.17,25.4 65.79,25.78 65.79,28.7 65.66,28.83 U6.33 ; 66.59,25.4 70.18,25.4 70.2,25.38
  Bottom Layer w0.381: v1(66.55,17.53) v1(66.55,24.13)
V_SCLK: length 32.2
  Top Layer w0.381: v1(68.33,17.53) 68.33,14.86 68.71,14.48 70.36,14.48 70.99,15.11 U3.3 ; U6.31 64.47,27.23 64.72,26.97 64.72,21.51 65.41,20.83 68.31,20.83 ; 68.31,20.83 68.33,20.82 v1(68.33,19.81) ; 68.31,20.83 70.18,20.83 70.2,20.81
  Bottom Layer w0.381: v1(68.33,17.53) v1(68.33,19.81)
VUSB: length 40.8
  Top Layer w0.762: CN1.1 15.24,11.94 ; 15.24,11.94 14.86,11.56 11.94,11.56 11.3,12.19 11.3,18.16 11.43,18.29 15.24,18.29 15.62,18.67 15.62,21.72 15.75,21.84 27.85,21.84 U2.16 ; 15.24,11.94 15.24,6.6 15.49,6.35 16.47,6.35 Q1.2
  vias: v1(18.32,5.84) v1(24.89,5.84)
$1N50: length 7.9
  Top Layer w0.381: H1.1 86.74,27.69 86.11,28.32 86.11,32.13 85.87,32.36 84.61,32.36
$1N51: length 24.9
  Top Layer w0.381: U1.3 70.87,26.54 70.74,26.42 67.94,26.42 67.69,26.67 67.69,30.99 68.07,31.37 82.42,31.37 82.52,31.46 R2.1
$1N54: length 19.6
  Top Layer w0.381: R6.2 R5.1 84.17,29.78 83.76,29.78 v1(83.69,29.84) ; v1(70.23,29.84) 69.6,29.21 U1.2
  Bottom Layer w0.381: v1(70.23,29.84) 70.74,30.35 83.44,30.35 83.69,30.1 v1(83.69,29.84)
$1N55: length 20.3
  Top Layer w0.381: 73.41,28.83 73.41,28.96 71.53,30.84 70.21,30.84 68.33,28.96 U1.1 ; 73.41,28.83 U1.5 ; 73.41,28.83 75.06,30.48 78.87,30.48 80.26,29.08 80.26,28.07 80.41,27.92 R6.1
$1N115: length 16.5
  Top Layer w0.381: B1.1 18.03,39.5 20.57,36.96 v1(20.57,35.69) ; v1(20.57,32.39) 20.57,30.86
  Bottom Layer w0.381: v1(20.57,35.69) v1(20.57,32.39)
$1N118: length 2.9
  Top Layer w0.254: X1.1 13.53,27.94 14.34,28.75 14.86,28.75 U4.3
$1N119: length 2.9
  Top Layer w0.254: U4.2 14.86,29.16 14.34,29.16 13.53,29.97 X1.2
$1N152: length 7.8
  Top Layer w0.381: U3.6 70.99,8 70.74,7.75 66.93,7.75 66.8,7.62 66.8,6.66 R14.1
$1N153: length 6.3
  Top Layer w0.381: 72.26,10.41 72.26,9.78 71.75,9.27 71.75,7.11 71.25,6.6 69.23,6.6 R12.1
$1N156: length 27.6
  Top Layer w0.381: R14.2 66.78,5.06 67.18,5.46 71.12,5.46 71.5,5.08 82.04,5.08 82.55,5.59 82.55,14.99 82.8,15.24 83.69,15.24 SP1.2
$1N157: length 17.8
  Top Layer w0.381: R12.2 69.48,4.32 83.19,4.32 83.82,4.95 83.82,7.75
$1N174: length 14.5
  Top Layer w0.381: SW1.3 v1(24.87,1.3) SW1.2 v1(18.32,1.3) 17.45,1.3 16.99,1.76 17,1.77 Q1.1
$1N177: length 3.8
  Top Layer w0.381: U2.5 21.21,15.75 20.73,15.27 R4.1
$1N178: length 4.8
  Top Layer w0.381: R3.1 21.72,12.56 21.72,14.22 21.97,14.48 U2.6
$1N181: length 2.6
  Top Layer w0.381: C3.2 23.35,17 U2.4
$1N182: length 18.8
  Top Layer w0.381: U2.3 25.17,18.29 26.39,17.07 26.39,11.34 27.31,10.42 31.25,10.42 31.62,10.79 35.06,10.79 35.28,10.57
$1N183: length 17.5
  Top Layer w0.381: D1.1 32.34,13.21 30.73,13.21 30.48,12.95 30.48,11.56 30.1,11.18 27.31,11.18 26.92,11.56 26.92,17.29 24.66,19.56 U2.2
$1N192: length 8.6
  Top Layer w0.381: R4.2 18.64,14.35 17.65,14.35 17.4,14.61 17.4,16.64 16.51,17.53 14.53,17.53 CN1.3
$1N193: length 7.7
  Top Layer w0.381: R3.2 18.68,11.56 17.14,11.56 16.76,11.94 16.76,15.88 16.43,16.21 CN1.2
$1N730: length 2
  Top Layer w0.381: LED1.1 R7.1
$1N1892: length 33.2
  Top Layer w0.381: R21.2 78.47,37.44 76.92,35.9 67.94,35.9 67.56,35.52 67.56,33.66 65.79,31.88 56.9,31.88 56.26,32.51 U5.15
$1N2944: length 28.6
  Top Layer w0.381: U5.7 49.91,42.69 50.15,42.93 59.69,42.93 60.2,42.42 75.82,42.42 76.07,42.16 76.07,41.46 R27.1
$1N2950: length 29
  Top Layer w0.381: U5.6 51.18,39.12 52.68,37.62 73.34,37.62 73.72,38 R26.1
$1N2953: length 24.7
  Top Layer w0.381: U5.5 52.45,38.86 53.16,38.15 70.87,38.15 71.25,38.53 71.25,41.33 R25.1
$1N2956: length 20.4
  Top Layer w0.381: U5.4 53.72,39.24 54.28,38.68 68.83,38.68 69.09,38.94 69.09,41.33 R24.1
$1N2959: length 15.6
  Top Layer w0.381: R23.1 66.55,41.37 66.55,39.6 66.17,39.22 55.27,39.22 54.99,39.5 U5.3
$1N2962: length 11
  Top Layer w0.381: U5.2 56.26,40 56.51,39.75 63.88,39.75 64.13,40 64.13,41.33 R22.1
$1N2965: length 4.4
  Top Layer w0.381: U5.1 61.84,41.4 R19.1
$1N3067: length 16.2
  Top Layer w0.381: U7.14 v1(36.89,33.78) ; v1(48.64,33.66) 48.64,35.9
  Bottom Layer w0.381: v1(36.89,33.78) 48.51,33.78 v1(48.64,33.66)

## Copper pours and planes (outline as drawn; the poured copper is in the pictures)
GND on Top Layer: -6.73,62.48 106.43,62.48 106.43,-13.84 -6.73,-13.84
GND on Bottom Layer: -5.46,62.99 96.39,62.99 96.39,-11.56 -5.46,-11.56
VDD_NODE_A on Top Layer: 12.83,33.27 15.88,33.27 15.88,30.35 12.83,30.35
VDD_NODE_A on Top Layer: 45.13,20.19 57.78,20.19 57.78,10.41 45.13,10.41
VDD_NODE_A on Top Layer: 38.91,37.13 42.54,37.13 42.54,34.67 38.91,34.67
VDD_NODE_A on Top Layer: 72.52,11.43 74.29,11.43 74.29,5.46 72.52,5.46
VDD_NODE_A on Top Layer: 71.5,28.96 72.99,28.96 72.99,17.63 71.5,17.63
VDD_NODE_A on Top Layer: 22.48,37.08 32.51,37.08 32.51,32.89 22.48,32.89
VDD_NODE_A on Top Layer: 57.15,37.08 63.2,37.08 63.2,34.67 57.15,34.67
VDD_NODE_A on Top Layer: 12.06,5.97 15.49,5.97 15.49,1.14 12.06,1.14
VUSB on Top Layer: 27.69,22.48 36.83,22.48 36.83,19.05 27.69,19.05
VUSB on Top Layer: 16.26,6.48 30.61,6.48 30.61,5.21 16.26,5.21

Small or netless copper shapes (teardrops, artwork), in the pictures only: 238 on Top Layer, 71 on Bottom Layer
